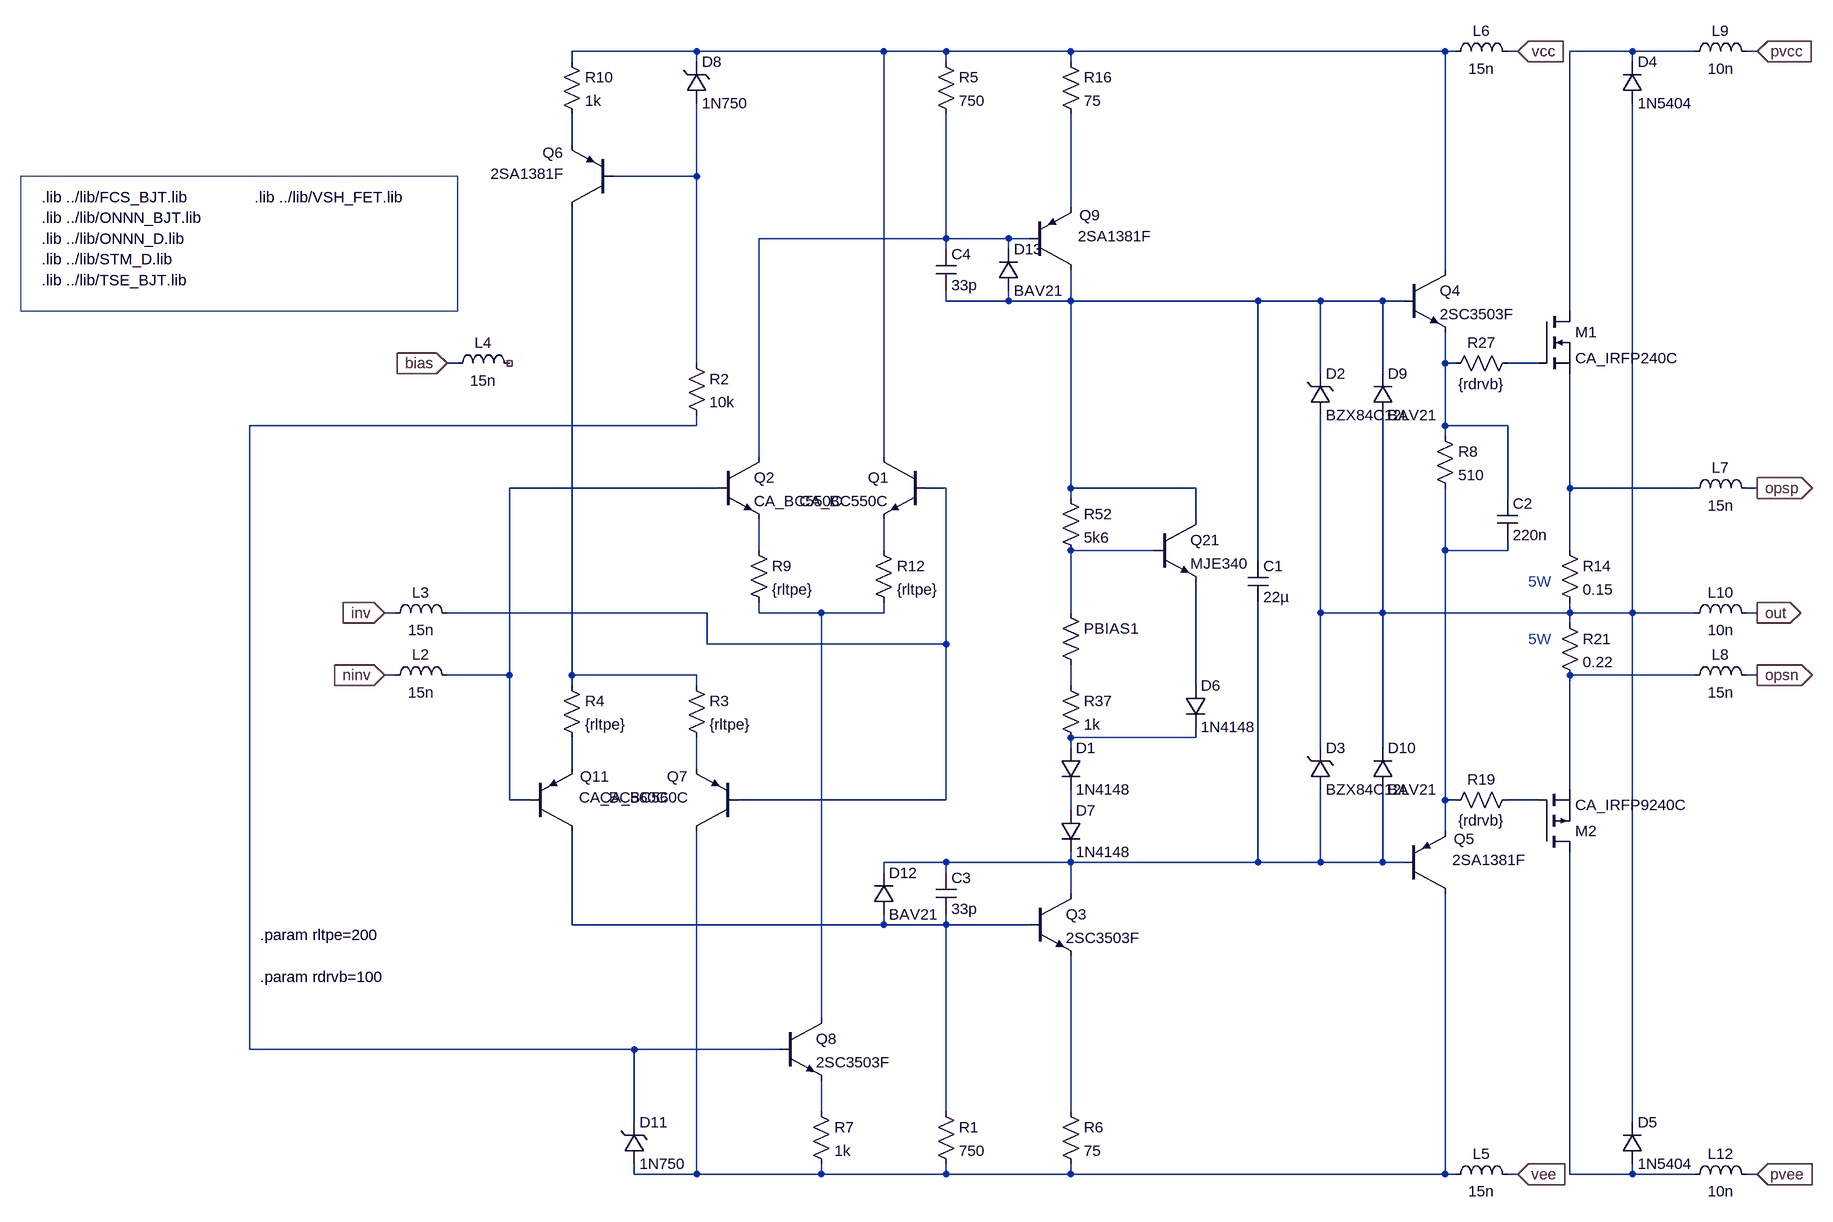
[diagram p0: schematic pab3bbb-compact-module-pp2.asc]
pab3bbb-compact-module-pp2.asc, the LTspice schematic file:
Version 4
SHEET 1 6124 2336
WIRE 192 -1088 0 -1088
WIRE 480 -1088 192 -1088
WIRE 576 -1088 480 -1088
WIRE 768 -1088 576 -1088
WIRE 1344 -1088 768 -1088
WIRE 1360 -1088 1344 -1088
WIRE 1456 -1088 1440 -1088
WIRE 1632 -1088 1536 -1088
WIRE 1728 -1088 1632 -1088
WIRE 1824 -1088 1808 -1088
WIRE 0 -1072 0 -1088
WIRE 192 -1072 192 -1088
WIRE 576 -1072 576 -1088
WIRE 768 -1072 768 -1088
WIRE 1632 -1072 1632 -1088
WIRE 0 -944 0 -992
WIRE 192 -896 192 -1008
WIRE 192 -896 64 -896
WIRE 768 -848 768 -992
WIRE 576 -800 576 -992
WIRE 576 -800 288 -800
WIRE 672 -800 576 -800
WIRE 704 -800 672 -800
WIRE 576 -784 576 -800
WIRE 672 -784 672 -800
WIRE 1344 -752 1344 -1088
WIRE 576 -704 576 -720
WIRE 672 -704 672 -720
WIRE 672 -704 576 -704
WIRE 768 -704 768 -752
WIRE 768 -704 672 -704
WIRE 1056 -704 768 -704
WIRE 1152 -704 1056 -704
WIRE 1248 -704 1152 -704
WIRE 1280 -704 1248 -704
WIRE 1536 -688 1536 -1088
WIRE -176 -608 -192 -608
WIRE 192 -608 192 -896
WIRE 1344 -608 1344 -656
WIRE 1360 -608 1344 -608
WIRE 1488 -608 1440 -608
WIRE 1152 -592 1152 -704
WIRE 1248 -592 1248 -704
WIRE 192 -512 192 -528
WIRE 192 -512 -496 -512
WIRE 1344 -512 1344 -608
WIRE 1440 -512 1344 -512
WIRE 1344 -496 1344 -512
WIRE 288 -464 288 -800
WIRE 480 -464 480 -1088
WIRE 224 -416 -96 -416
WIRE 576 -416 544 -416
WIRE 768 -416 768 -704
WIRE 960 -416 768 -416
WIRE 1536 -416 1536 -592
WIRE 1728 -416 1536 -416
WIRE 1824 -416 1808 -416
WIRE 768 -400 768 -416
WIRE 1440 -400 1440 -512
WIRE 960 -368 960 -416
WIRE 288 -320 288 -368
WIRE 480 -320 480 -368
WIRE 896 -320 768 -320
WIRE 1344 -320 1344 -416
WIRE 1440 -320 1440 -336
WIRE 1440 -320 1344 -320
WIRE 1536 -320 1536 -416
WIRE 1056 -304 1056 -704
WIRE -272 -224 -288 -224
WIRE 208 -224 -192 -224
WIRE 288 -224 288 -240
WIRE 384 -224 288 -224
WIRE 480 -224 480 -240
WIRE 480 -224 384 -224
WIRE 768 -224 768 -320
WIRE 1152 -224 1152 -528
WIRE 1248 -224 1248 -528
WIRE 1248 -224 1152 -224
WIRE 1536 -224 1536 -240
WIRE 1536 -224 1248 -224
WIRE 1632 -224 1632 -1008
WIRE 1632 -224 1536 -224
WIRE 1728 -224 1632 -224
WIRE 1824 -224 1808 -224
WIRE 1536 -208 1536 -224
WIRE 208 -176 208 -224
WIRE 576 -176 576 -416
WIRE 576 -176 208 -176
WIRE -272 -128 -288 -128
WIRE -96 -128 -96 -416
WIRE -96 -128 -192 -128
WIRE 0 -128 0 -848
WIRE 192 -128 0 -128
WIRE 1728 -128 1536 -128
WIRE 1824 -128 1808 -128
WIRE 0 -112 0 -128
WIRE 192 -112 192 -128
WIRE 768 -112 768 -144
WIRE 960 -112 960 -272
WIRE 960 -32 960 -48
WIRE 960 -32 768 -32
WIRE 768 -16 768 -32
WIRE 1152 -16 1152 -224
WIRE 1248 -16 1248 -224
WIRE 0 16 0 -32
WIRE 192 16 192 -32
WIRE 1536 48 1536 -128
WIRE -96 64 -96 -128
WIRE -64 64 -96 64
WIRE 576 64 576 -176
WIRE 576 64 256 64
WIRE 1344 64 1344 -320
WIRE 1360 64 1344 64
WIRE 1488 64 1440 64
WIRE 768 80 768 48
WIRE 1344 112 1344 64
WIRE 576 160 480 160
WIRE 768 160 768 144
WIRE 768 160 576 160
WIRE 1056 160 1056 -240
WIRE 1056 160 768 160
WIRE 1152 160 1152 48
WIRE 1152 160 1056 160
WIRE 1248 160 1248 48
WIRE 1248 160 1152 160
WIRE 1280 160 1248 160
WIRE 480 176 480 160
WIRE 576 176 576 160
WIRE 768 208 768 160
WIRE 0 256 0 112
WIRE 480 256 480 240
WIRE 480 256 0 256
WIRE 576 256 576 240
WIRE 576 256 480 256
WIRE 704 256 576 256
WIRE 384 400 384 -224
WIRE -496 448 -496 -512
WIRE 96 448 -496 448
WIRE 320 448 96 448
WIRE 384 544 384 496
WIRE 576 544 576 256
WIRE 768 544 768 304
WIRE 96 560 96 448
WIRE 1632 560 1632 -224
WIRE 96 640 96 624
WIRE 192 640 192 112
WIRE 192 640 96 640
WIRE 384 640 384 624
WIRE 384 640 192 640
WIRE 576 640 576 624
WIRE 576 640 384 640
WIRE 768 640 768 624
WIRE 768 640 576 640
WIRE 1344 640 1344 208
WIRE 1344 640 768 640
WIRE 1360 640 1344 640
WIRE 1456 640 1440 640
WIRE 1536 640 1536 144
WIRE 1632 640 1632 624
WIRE 1632 640 1536 640
WIRE 1728 640 1632 640
WIRE 1824 640 1808 640
FLAG 1824 -1088 pvcc
IOPIN 1824 -1088 In
FLAG 1824 640 pvee
IOPIN 1824 640 In
FLAG 1824 -224 out
IOPIN 1824 -224 Out
FLAG 1456 -1088 vcc
IOPIN 1456 -1088 In
FLAG 1456 640 vee
IOPIN 1456 640 In
FLAG -288 -128 ninv
IOPIN -288 -128 In
FLAG -288 -224 inv
IOPIN -288 -224 In
FLAG 1824 -416 opsp
IOPIN 1824 -416 Out
FLAG 1824 -128 opsn
IOPIN 1824 -128 Out
FLAG -192 -608 bias
IOPIN -192 -608 In
SYMBOL pnp -64 112 M180
WINDOW 0 77 84 Left 2
WINDOW 3 75 52 Left 2
SYMATTR InstName Q11
SYMATTR Value CA_BC560C
SYMBOL res 752 -1088 R0
SYMATTR InstName R16
SYMATTR Value 75
SYMBOL res 1456 -624 R90
WINDOW 0 0 56 VBottom 2
WINDOW 3 32 56 VTop 2
SYMATTR InstName R27
SYMATTR Value {rdrvb}
SYMBOL res 752 -240 R0
WINDOW 3 36 76 Invisible 2
SYMATTR Value {1+(500*BIAS)}
SYMATTR InstName PBIAS1
SYMBOL res 752 -416 R0
SYMATTR InstName R52
SYMATTR Value 5k6
SYMBOL npn 704 208 R0
SYMATTR InstName Q3
SYMATTR Value 2SC3503F
SYMBOL res 752 528 R0
SYMATTR InstName R6
SYMATTR Value 75
SYMBOL pnp 256 112 R180
WINDOW 0 77 84 Left 2
WINDOW 3 75 52 Left 2
SYMATTR InstName Q7
SYMATTR Value CA_BC560C
SYMBOL npn 896 -368 R0
SYMATTR InstName Q21
SYMATTR Value MJE340
SYMBOL res 752 -128 R0
SYMATTR InstName R37
SYMATTR Value 1k
SYMBOL res 1520 -336 R0
SYMATTR InstName R14
SYMATTR Value 0.15
SYMBOL res 1520 -224 R0
SYMATTR InstName R21
SYMATTR Value 0.22
SYMBOL ind 1344 656 R270
WINDOW 0 32 56 VTop 2
WINDOW 3 5 56 VBottom 2
SYMATTR InstName L5
SYMATTR Value 15n
SYMATTR SpiceLine Rser=20m
SYMBOL ind 1344 -1072 R270
WINDOW 0 32 56 VTop 2
WINDOW 3 5 56 VBottom 2
SYMATTR InstName L6
SYMATTR Value 15n
SYMATTR SpiceLine Rser=20m
SYMBOL ind 1712 -400 R270
WINDOW 0 32 56 VTop 2
WINDOW 3 5 56 VBottom 2
SYMATTR InstName L7
SYMATTR Value 15n
SYMATTR SpiceLine Rser=20m
SYMBOL ind 1712 -112 R270
WINDOW 0 32 56 VTop 2
WINDOW 3 5 56 VBottom 2
SYMATTR InstName L8
SYMATTR Value 15n
SYMATTR SpiceLine Rser=20m
SYMBOL ind -288 -112 R270
WINDOW 0 32 56 VTop 2
WINDOW 3 5 56 VBottom 2
SYMATTR InstName L2
SYMATTR Value 15n
SYMATTR SpiceLine Rser=20m
SYMBOL ind -288 -208 R270
WINDOW 0 32 56 VTop 2
WINDOW 3 5 56 VBottom 2
SYMATTR InstName L3
SYMATTR Value 15n
SYMATTR SpiceLine Rser=20m
SYMBOL ind 1712 -208 R270
WINDOW 0 32 56 VTop 2
WINDOW 3 5 56 VBottom 2
SYMATTR InstName L10
SYMATTR Value 10n
SYMATTR SpiceLine Rser=10m
SYMBOL ind 1712 -1072 R270
WINDOW 0 32 56 VTop 2
WINDOW 3 5 56 VBottom 2
SYMATTR InstName L9
SYMATTR Value 10n
SYMATTR SpiceLine Rser=10m
SYMBOL ind 1712 656 R270
WINDOW 0 32 56 VTop 2
WINDOW 3 5 56 VBottom 2
SYMATTR InstName L12
SYMATTR Value 10n
SYMATTR SpiceLine Rser=10m
SYMBOL ind -192 -592 R270
WINDOW 0 32 56 VTop 2
WINDOW 3 5 56 VBottom 2
SYMATTR InstName L4
SYMATTR Value 15n
SYMATTR SpiceLine Rser=20m
SYMBOL zener 1136 -528 M180
WINDOW 0 24 64 Left 2
WINDOW 3 24 0 Left 2
SYMATTR InstName D2
SYMATTR Value BZX84C12L
SYMATTR Description Diode
SYMATTR Type diode
SYMBOL diode 1616 -1008 M180
WINDOW 0 24 64 Left 2
WINDOW 3 24 0 Left 2
SYMATTR InstName D4
SYMATTR Value 1N5404
SYMBOL diode 1616 624 M180
WINDOW 0 24 64 Left 2
WINDOW 3 24 0 Left 2
SYMATTR InstName D5
SYMATTR Value 1N5404
SYMBOL res 1456 48 R90
WINDOW 0 0 56 VBottom 2
WINDOW 3 32 56 VTop 2
SYMATTR InstName R19
SYMATTR Value {rdrvb}
SYMBOL nmos 1488 -688 R0
SYMATTR InstName M1
SYMATTR Value CA_IRFP240C
SYMBOL pmos 1488 144 M180
SYMATTR InstName M2
SYMATTR Value CA_IRFP9240C
SYMBOL diode 944 -112 R0
SYMATTR InstName D6
SYMATTR Value 1N4148
SYMBOL pnp 704 -752 M180
WINDOW 0 77 84 Left 2
WINDOW 3 75 52 Left 2
SYMATTR InstName Q9
SYMATTR Value 2SA1381F
SYMBOL zener 1136 48 M180
WINDOW 0 24 64 Left 2
WINDOW 3 24 0 Left 2
SYMATTR InstName D3
SYMATTR Value BZX84C12L
SYMATTR Description Diode
SYMATTR Type diode
SYMBOL diode 1232 -528 M180
WINDOW 0 24 64 Left 2
WINDOW 3 24 0 Left 2
SYMATTR InstName D9
SYMATTR Value BAV21
SYMBOL diode 1232 48 M180
WINDOW 0 24 64 Left 2
WINDOW 3 24 0 Left 2
SYMATTR InstName D10
SYMATTR Value BAV21
SYMBOL res 560 528 R0
SYMATTR InstName R1
SYMATTR Value 750
SYMBOL res 560 -1088 R0
SYMATTR InstName R5
SYMATTR Value 750
SYMBOL cap 1040 -304 R0
SYMATTR InstName C1
SYMATTR Value 22µ
SYMBOL res -16 -128 R0
SYMATTR InstName R4
SYMATTR Value {rltpe}
SYMBOL diode 752 -16 R0
SYMATTR InstName D1
SYMATTR Value 1N4148
SYMBOL diode 752 80 R0
SYMATTR InstName D7
SYMATTR Value 1N4148
SYMBOL npn 1280 -752 R0
SYMATTR InstName Q4
SYMATTR Value 2SC3503F
SYMBOL pnp 1280 208 M180
WINDOW 0 77 84 Left 2
WINDOW 3 75 52 Left 2
SYMATTR InstName Q5
SYMATTR Value 2SA1381F
SYMBOL res 1328 -512 R0
SYMATTR InstName R8
SYMATTR Value 510
SYMBOL cap 1424 -400 R0
SYMATTR InstName C2
SYMATTR Value 220n
SYMBOL cap 560 176 R0
SYMATTR InstName C3
SYMATTR Value 33p
SYMBOL cap 560 -784 R0
SYMATTR InstName C4
SYMATTR Value 33p
SYMBOL res 176 -128 R0
SYMATTR InstName R3
SYMATTR Value {rltpe}
SYMBOL pnp 64 -848 R180
WINDOW 0 77 84 Left 2
WINDOW 3 75 52 Left 2
SYMATTR InstName Q6
SYMATTR Value 2SA1381F
SYMBOL res -16 -1088 R0
SYMATTR InstName R10
SYMATTR Value 1k
SYMBOL zener 176 -1008 M180
WINDOW 0 24 64 Left 2
WINDOW 3 24 0 Left 2
SYMATTR InstName D8
SYMATTR Value 1N750
SYMATTR Description Diode
SYMATTR Type diode
SYMBOL npn 544 -464 M0
SYMATTR InstName Q1
SYMATTR Value CA_BC550C
SYMBOL npn 224 -464 R0
SYMATTR InstName Q2
SYMATTR Value CA_BC550C
SYMBOL npn 320 400 R0
SYMATTR InstName Q8
SYMATTR Value 2SC3503F
SYMBOL zener 80 624 M180
WINDOW 0 24 64 Left 2
WINDOW 3 24 0 Left 2
SYMATTR InstName D11
SYMATTR Value 1N750
SYMATTR Description Diode
SYMATTR Type diode
SYMBOL res 176 -624 R0
SYMATTR InstName R2
SYMATTR Value 10k
SYMBOL res 368 528 R0
SYMATTR InstName R7
SYMATTR Value 1k
SYMBOL res 272 -336 R0
SYMATTR InstName R9
SYMATTR Value {rltpe}
SYMBOL res 464 -336 R0
SYMATTR InstName R12
SYMATTR Value {rltpe}
SYMBOL diode 464 240 M180
WINDOW 0 24 64 Left 2
WINDOW 3 24 0 Left 2
SYMATTR InstName D12
SYMATTR Value BAV21
SYMBOL diode 656 -720 M180
WINDOW 0 24 64 Left 2
WINDOW 3 24 0 Left 2
SYMATTR InstName D13
SYMATTR Value BAV21
TEXT -480 272 Left 2 !.param rltpe=200
TEXT 1472 -272 Left 2 ;5W
TEXT 1472 -184 Left 2 ;5W
TEXT -816 -832 Left 2 !.lib ../lib/ONNN_BJT.lib
TEXT -816 -768 Left 2 !.lib ../lib/STM_D.lib
TEXT -816 -864 Left 2 !.lib ../lib/FCS_BJT.lib
TEXT -816 -800 Left 2 !.lib ../lib/ONNN_D.lib
TEXT -816 -736 Left 2 !.lib ../lib/TSE_BJT.lib
TEXT -480 336 Left 2 !.param rdrvb=100
TEXT -488 -864 Left 2 !.lib ../lib/VSH_FET.lib
RECTANGLE Normal -176 -688 -848 -896

The netlist it stands for:
* pab3bbb-compact-module-pp2.asc
Q11 N030 N011 N025 0 CA_BC560C
R16 N001 N005 75
R27 N009 N008 {rdrvb}
R§PBIAS1 N016 N022 {1+(500*BIAS)}
R52 N007 N016 5k6
Q3 N029 N030 N032 0 2SC3503F
R6 N032 N033 75
Q7 N033 N012 N026 0 CA_BC560C
Q21 N007 N016 N023 0 MJE340
R37 N022 N024 1k
R14 N013 N019 0.15
R21 N019 N021 0.22
L5 N033 vee 15n Rser=20m
L6 N001 vcc 15n Rser=20m
L7 N013 opsp 15n Rser=20m
L8 N021 opsn 15n Rser=20m
L2 ninv N011 15n Rser=20m
L3 inv N012 15n Rser=20m
L10 N019 out 10n Rser=10m
L9 N002 pvcc 10n Rser=10m
L12 N034 pvee 10n Rser=10m
L4 bias NC_01 15n Rser=20m
D2 N019 N007 BZX84C12L
D4 N019 N002 1N5404
D5 N034 N019 1N5404
R19 N027 N017 {rdrvb}
M1 N002 N009 N013 N013 CA_IRFP240C
M2 N034 N027 N021 N021 CA_IRFP9240C
D6 N023 N024 1N4148
Q9 N007 N006 N005 0 2SA1381F
D3 N029 N019 BZX84C12L
D9 N019 N007 BAV21
D10 N029 N019 BAV21
R1 N030 N033 750
R5 N001 N006 750
C1 N007 N029 22µ
R4 N020 N025 {rltpe}
D1 N024 N028 1N4148
D7 N028 N029 1N4148
Q4 N001 N007 N008 0 2SC3503F
Q5 N033 N029 N017 0 2SA1381F
R8 N008 N017 510
C2 N008 N017 220n
C3 N029 N030 33p
C4 N006 N007 33p
R3 N020 N026 {rltpe}
Q6 N020 N004 N003 0 2SA1381F
R10 N001 N003 1k
D8 N004 N001 1N750
Q1 N001 N012 N015 0 CA_BC550C
Q2 N006 N011 N014 0 CA_BC550C
Q8 N018 N010 N031 0 2SC3503F
D11 N033 N010 1N750
R2 N004 N010 10k
R7 N031 N033 1k
R9 N014 N018 {rltpe}
R12 N015 N018 {rltpe}
D12 N030 N029 BAV21
D13 N007 N006 BAV21
.model D D
.lib standard.dio
.model NPN NPN
.model PNP PNP
.lib standard.bjt
.model NMOS NMOS
.model PMOS PMOS
.lib standard.mos
.param rltpe=200
* 5W
* 5W
.lib ../lib/ONNN_BJT.lib
.lib ../lib/STM_D.lib
.lib ../lib/FCS_BJT.lib
.lib ../lib/ONNN_D.lib
.lib ../lib/TSE_BJT.lib
.param rdrvb=100
.lib ../lib/VSH_FET.lib
.backanno
.end